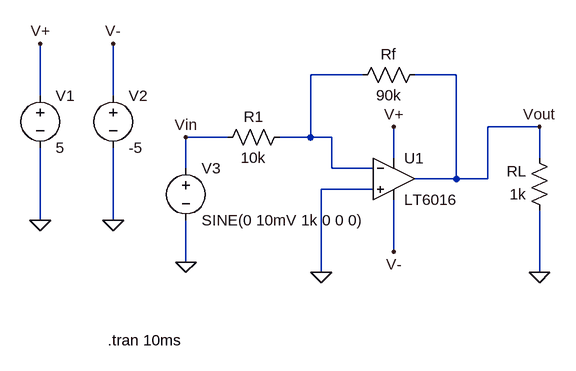
[diagram p0: schematic Draft3.asc]
Draft3.asc, the LTspice schematic file:
Version 4.1
SHEET 1 880 680
WIRE 272 32 192 32
WIRE 416 32 352 32
WIRE -224 64 -224 -16
WIRE -112 64 -112 -16
WIRE 544 112 464 112
WIRE 64 128 0 128
WIRE 192 128 192 32
WIRE 192 128 144 128
WIRE 224 128 192 128
WIRE 320 160 320 112
WIRE 544 160 544 112
WIRE 0 176 0 128
WIRE 224 176 224 128
WIRE 288 176 224 176
WIRE 416 192 416 32
WIRE 416 192 352 192
WIRE 464 192 464 112
WIRE 464 192 416 192
WIRE 288 208 208 208
WIRE -224 256 -224 144
WIRE -112 256 -112 144
WIRE 320 304 320 224
WIRE 0 320 0 256
WIRE 208 336 208 208
WIRE 544 336 544 240
FLAG -224 256 0
FLAG -112 256 0
FLAG 0 320 0
FLAG 208 336 0
FLAG 544 336 0
FLAG -224 -16 V+
FLAG 320 112 V+
FLAG -112 -16 V-
FLAG 320 304 V-
FLAG 544 112 Vout
FLAG 0 128 Vin
SYMBOL OpAmps\\LT6016 320 192 R0
SYMATTR InstName U1
SYMBOL voltage -224 48 R0
SYMATTR InstName V1
SYMATTR Value 5
SYMBOL voltage -112 48 R0
SYMATTR InstName V2
SYMATTR Value -5
SYMBOL voltage 0 160 R0
SYMATTR InstName V3
SYMATTR Value SINE(0 10mV 1k 0 0 0)
SYMBOL res 160 112 R90
WINDOW 0 0 56 VBottom 2
WINDOW 3 32 56 VTop 2
SYMATTR InstName R1
SYMATTR Value 10k
SYMBOL res 368 16 R90
WINDOW 0 0 56 VBottom 2
WINDOW 3 32 56 VTop 2
SYMATTR InstName Rf
SYMATTR Value 90k
SYMBOL res 560 256 R180
WINDOW 0 36 76 Left 2
WINDOW 3 36 40 Left 2
SYMATTR InstName RL
SYMATTR Value 1k
TEXT -120 440 Left 2 !.tran 10ms

The netlist it stands for:
* Draft3.asc
* U1: LT6016 (symbol OpAmps\LT6016 not available, pins judged from their places): In+=0 In-=N001 V+=V+ V-=V- OUT=Vout
V1 V+ 0 5
V2 V- 0 -5
V3 Vin 0 SINE(0 10mV 1k 0 0 0)
R1 N001 Vin 10k
Rf Vout N001 90k
RL 0 Vout 1k
.tran 10ms
.backanno
.end